# Altium schematic sheet main.SchDoc
size A; SheetNumber: 1; SheetTotal: 1
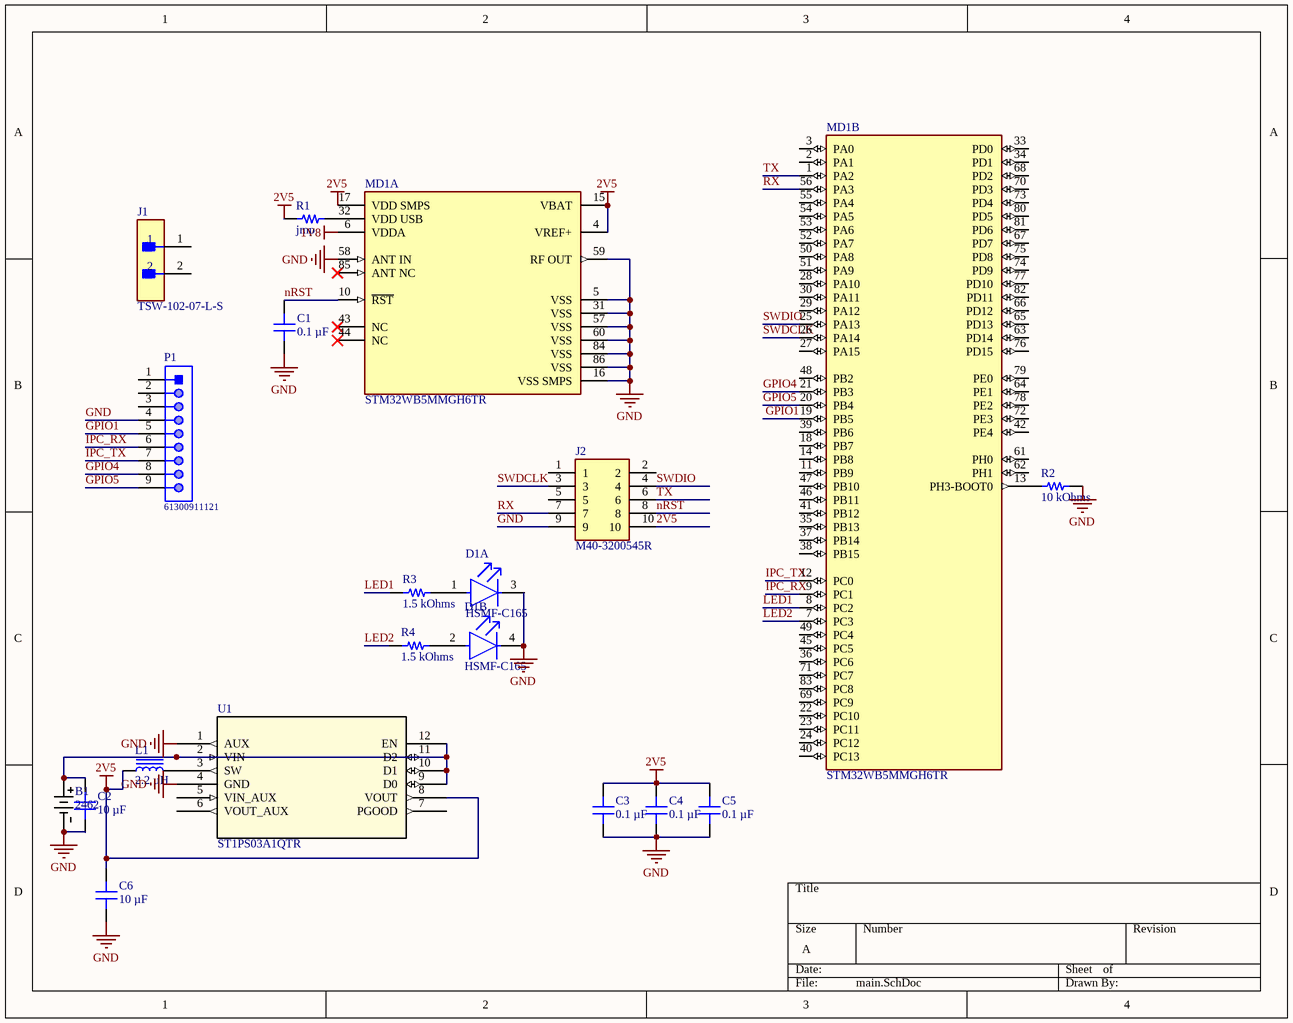
[diagram p0: main.SchDoc]

## Parts
B1  2462  [2462_KEY]
C1  0.1 µF  [CAP 0402_1005]
C2  10 µF  [CAP 0603_1608]
C3  0.1 µF  [CAP 0402_1005]
C4  0.1 µF  [CAP 0402_1005]
C5  0.1 µF  [CAP 0402_1005]
C6  10 µF  [CAP 0603_1608]
D1  HSMF-C165  [FP-HSMF-C165-MFG]  (parts A,B of 2)
J1  TSW-102-07-L-S  [FP-TSW-102-07-L-S-MFG]
J2  M40-3200545R  [HARWIN_M40-3200545R]
L1  2.2 µH  [TDK VLS201612CX]
MD1  STM32WB5MMGH6TR  [FP-STM32WB5MMGH6TR-MFG]  (parts A,B of 2)
P1  61300911121  [61300911121]
R1  jmp  [RES 0402_1005]
R2  10 kOhms  [RES 0402_1005]
R3  1.5 kOhms  [RES 0402_1005]
R4  1.5 kOhms  [RES 0402_1005]
U1  ST1PS03A1QTR  [TQFN12_2X1P7_STM]

## Nets
1V8: MD1.6(VDDA)
2V5: C3.2 C4.2 C5.2 C6.2 J2.10 L1.1 MD1.4(VREF+) MD1.15(VBAT) MD1.17(VDD_SMPS) R1.1 U1.8(VOUT)
GND: B1.1 C1.2 C2.1 C3.1 C4.1 C5.1 C6.1 D1.4(RED_C) J2.9 MD1.5(VSS) MD1.16(VSS_SMPS) MD1.31(VSS) MD1.57(VSS) MD1.58(ANT_IN) MD1.59(RF_OUT) MD1.60(VSS) MD1.84(VSS) MD1.86(VSS) P1.4 R2.1 U1.1(AUX) U1.4(GND)
GPIO1: MD1.19(PB5) P1.5
GPIO4: MD1.21(PB3) P1.8
GPIO5: MD1.20(PB4) P1.9
IPC_RX: MD1.9(PC1) P1.6
IPC_TX: MD1.12(PC0) P1.7
LED1: MD1.8(PC2) R3.2
LED2: MD1.7(PC3) R4.2
nRST: C1.1 J2.8 MD1.10(~{RST})
RX: J2.7 MD1.56(PA3)
SWDCLK: J2.3 MD1.26(PA14)
SWDIO: J2.4 MD1.25(PA13)
TX: J2.6 MD1.1(PA2)
NetB1_2: B1.2 C2.2 U1.2(VIN) U1.9(D0) U1.10(D1) U1.11(D2) U1.12(EN)
NetD1_1: D1.1(GREEN_A) R3.1
NetD1_2: D1.2(RED_A) R4.1
NetL1_2: L1.2 U1.3(SW)
NetMD1_13: MD1.13(PH3-BOOT0) R2.2
NetMD1_32: MD1.32(VDD_USB) R1.2

Not connected (* = marked no-connect by the designer): D1 3(GREEN_C); J1 1 2; J2 1 2 5; MD1 2(PA1) 3(PA0) 11(PB9) 14(PB8) 18(PB7) 22(PC10) 23(PC11) 24(PC12) 27(PA15) 28(PA10) 29(PA12) 30(PA11) 33(PD0) 34(PD1) 35(PB13) 36(PC6) 37(PB14) 38(PB15) 39(PB6) 40(PC13) 41(PB12) 42(PE4) 43(NC)* 44(NC)* 45(PC5) 46(PB11) 47(PB10) 48(PB2) 49(PC4) 50(PA8) 51(PA9) 52(PA7) 53(PA6) 54(PA5) 55(PA4) 61(PH0) 62(PH1) 63(PD14) 64(PE1) 65(PD13) 66(PD12) 67(PD7) 68(PD2) 69(PC9) 70(PD3) 71(PC7) 72(PE3) 73(PD4) 74(PD9) 75(PD8) 76(PD15) 77(PD10) 78(PE2) 79(PE0) 80(PD5) 81(PD6) 82(PD11) 83(PC8) 85(ANT_NC)*; P1 1 2 3; U1 5(VIN_AUX) 6(VOUT_AUX) 7(PGOOD)

## Library data of the parts
B1 = 2462: No Description Available; Mfr_Name: Keystone Electronics
C1 C4 C5 = C0402C104K7PAC7867: CAP CER 0.1UF 4V X5R 0402; manufacturer: KEMET; Tolerance: ±10%; Part Number: C0402C104K7PAC7867; Value: 0.1 µF; Applications: Bypass, Decoupling; Capacitance: 0.1 µF; componentlink1description: Datasheet; componentlink1url: https://api.kemet.com/component-edge/download/datasheet/C0402C104K7PAC7867.pdf; componentlink2description: DigiKey Link; componentlink2url: https://www.digikey.com/en/products/detail/kemet/C0402C104K7PAC7867/7381987; Device Package: 0402 (1005 Metric); lastupdated: 1/9/2022 12:30:40 pm; Lifecycle Status: Active; Minimum Order: 1; Mounting Type: Surface Mount, MLCC; Operating Temperature: -55°C ~ 85°C; Package / Case: 0402 (1005 Metric); packaging: TapeAndReel; partid: 5603; Part Status: Active; price: 0.01; series: SMD Comm X5R; Size / Dimension: 0.039" L x 0.020" W (1.00mm x 0.50mm); Supplier 1: DigiKey; Supplier Part Number 1: 399-14871-1-ND; Temperature Coefficient: X5R; Thickness (Max): 0.022" (0.55mm); Voltage - Rated: 4V
C2 C6 = GRM188R60J106ME47D: CAP CER 10UF 6.3V X5R 0603; manufacturer: Murata Electronics; Tolerance: ±20%; Part Number: GRM188R60J106ME47D; Value: 10 µF; Applications: General Purpose; Capacitance: 10 µF; componentlink1description: Datasheet; componentlink1url: https://www.murata.com/~/media/webrenewal/support/library/catalog/products/capacitor/mlcc/c02e.ashx?la=en-us; componentlink2description: DigiKey Link; componentlink2url: https://www.digikey.com/en/products/detail/murata-electronics/GRM188R60J106ME47D/965910; Device Package: 0603 (1608 Metric); lastupdated: 11/9/2022 9:40:24 am; Lifecycle Status: Active; Minimum Order: 1; Mounting Type: Surface Mount, MLCC; Operating Temperature: -55°C ~ 85°C; Package / Case: 0603 (1608 Metric); packaging: TapeAndReel; partid: 2351; Part Status: Active; price: 0.02; series: GRM; Size / Dimension: 0.063" L x 0.031" W (1.60mm x 0.80mm); Supplier 1: DigiKey; Supplier Part Number 1: 490-3896-1-ND; Temperature Coefficient: X5R; Thickness (Max): 0.035" (0.90mm); Voltage - Rated: 6.3V
C3 = C0402C104K4RECAUTO: CAP CER 0402 0.1UF 16V X7R 10%; manufacturer: KEMET; Part Number: C0402C104K4RECAUTO; Value: 0.1 µF; Applications: Automotive, ESD Protection; Capacitance: 0.1 µF; componentlink1description: Datasheet; componentlink1url: https://api.kemet.com/component-edge/download/datasheet/C0402C104K4RECAUTO.pdf; componentlink2description: DigiKey Link; componentlink2url: https://www.digikey.com/en/products/detail/kemet/C0402C104K4RECAUTO/8563695; Device Package: 0402 (1005 Metric); lastupdated: 1/9/2022 12:30:53 pm; Lifecycle Status: Active; Minimum Order: 1; Mounting Type: Surface Mount, MLCC; Operating Temperature: -55°C ~ 125°C; Package / Case: 0402 (1005 Metric); packaging: TapeAndReel; partid: 1731; Part Status: Active; price: 0.01; Ratings: AEC-Q200; series: ESD SMD Auto X7R; Size / Dimension: 0.039" L x 0.020" W (1.00mm x 0.50mm); Supplier 1: DigiKey; Supplier Part Number 1: 399-17167-1-ND; Temperature Coefficient: X7R; Thickness (Max): 0.022" (0.55mm); Tolerance: ±10%; Voltage - Rated: 16V
D1 = CMP-2000-06424-2: LED GREEN/RED DIFFUSED 0603 SMD; Reverse Voltage: 5V; Dominant Wavelength: 621nm; Number of Elements: 2; Shape: Rectangular; Luminous Intensity: 10mcd; Forward Current: 20mA; Lens Color: White; Illumination Color: Green; Power Dissipation: 52mW; Wavelength: 572nm; Viewing Angle: 120°; Forward Voltage: 2.2V; Max Operating Temperature: 85°C; Lens Transparency: Diffused; Width: 0.8mm; Case/Package: 0603; Packaging: Tape and Reel; Case Code (Metric): 1608; Depth: 0.8mm; REACH SVHC: No SVHC; Number of LEDs: 2; Radiation Hardening: No; Lens Style: Rectangular; Color: Green; Case Code (Imperial): 0603; Min Operating Temperature: -40°C; Power Rating: 52mW; Number of Pins: 4; Number of Terminals: 4; Package Quantity: 1; Mount: Surface Mount; Height: 0.5mm; Length: 1.6mm; Lead Free: Lead Free; Test Current: 20mA
J1 = CMP-02766-001428-1: CONN HEADER VERT 2POS 2.54MM; Voltage Rating: 550V; Current Rating: 7.6A; Gender: Male; Number of Contacts: 2; Connector Type: Male Pin; Radiation Hardening: No; Orientation: Straight; Contact Plating: Gold; Max Operating Temperature: 125°C; Mount: Through Hole; Package Quantity: 1; Number of Rows: 1; Housing Material: Polyester; RoHS Compliant: Yes; Length: 5.08mm; Max Voltage Rating (AC): 550V; Pitch: 2.54mm; Packaging: Bulk; Depth: 2.54mm; Termination: Solder; Min Operating Temperature: -55°C; Housing Color: Black; Lead Free: Lead Free; Color: Black; Number of Positions: 2; Width: 2.54mm; Max Current Rating: 7.6A; REACH SVHC: No SVHC; Contact Material: Bronze; Contact Mating Length: 0.23inch; Series: TSW; Contact Type: Male Pin
J2 = M40-3200545R: Connector Header Surface Mount 10 position 0.039 _1.00mm_; MF: Harwin Inc.; Package: None; MP: M40-3200545R; Value: *; Price: None; SnapEDA_Link: https://www.snapeda.com/parts/M40-3200545R/Harwin%20Inc./view-part/494409/?ref=snap; Availability: Unavailable
L1 = VLS201612CX-6R8M-1: FIXED IND 6.8UH 930MA 368MOHM SM; Manufacturer: TDK Corporation; Current - Saturation: 730mA; DC Resistance (DCR): 368mOhm Max; Inductance: 6.8 µH; Inductance Frequency - Test: 1 MHz; Material - Core: Ferrite; Shielding: Shielded; Tolerance: ±20%; Type: Drum Core, Wirewound; Part Number: VLS201612CX-6R8M-1; ComponentLink1Description: Datasheet; ComponentLink1URL: https://product.tdk.com/info/en/catalog/datasheets/inductor_commercial_power_vls201612cx-1_en.pdf?ref_disty=digikey; ComponentLink2Description: DigiKey Link; ComponentLink2URL: https://www.digikey.com/en/products/detail/tdk-corporation/VLS201612CX-6R8M-1/5169771; Current Rating (Amps): 930 mA; Device Package: Nonstandard; Height - Seated (Max): 0.047" (1.20mm); LastUpdated: 11/9/2022 10:31:03 am; Lifecycle Status: Active; Minimum Order: 1; Mounting Type: Surface Mount; Operating Temperature: -40°C ~ 105°C; Package / Case: Nonstandard; Packaging: TapeAndReel; PartId: 207; Part Status: Active; Price: 0.13; Series: VLS-CX-1; Size / Dimension: 0.079" L x 0.063" W (2.00mm x 1.60mm); Supplier 1: DigiKey; Supplier Part Number 1: 445-172966-1-ND; Supplier Device Package: 2016; Value: 2.2 µH
MD1 = CMP-12160-000017-1: ULTRA-LOW-POWER DUAL CORE ARM CO
P1 = CMP-1502-01080-1: THT Vertical Pin Header WR-PHD, Pitch 2.54 mm, Single Row, 9 pins; Manufacturer: Wurth Elektronik; Pitch: 2.54mm; Gender: Male; Working Voltage: 250VAC; Contact Resistance: 20mOhm; Withstanding Voltage: 500VAC; Pin Number: 9; Rated Current: 3A; Package Reference: 61300911121; Part Number: 61300911121; Mounting Technology: THT; Publisher: WurthElektronik; Manufacturer URL: http://www.we-online.de; Orientation: Vertical; Datasheet URL: https://katalog.we-online.de/em/datasheet/6130xx11121.pdf; Operating Temperature: -40to105degC; Row Number: Single; Packaging: Bag
R1 = RP73PF1E10KBTD: RES 10K OHM 0.1% 1/10W 0402; Manufacturer: TE Connectivity Passive Product; Power (Watts): 0.1W, 1/10W; Resistance: 10 kOhms; Temperature Coefficient: ±25ppm/°C; Part Number: RP73PF1E10KBTD; Value: jmp; ComponentLink1Description: Datasheet; ComponentLink1URL: https://www.te.com/commerce/DocumentDelivery/DDEController?Action=srchrtrv&DocNm=1773272&DocType=DS&DocLang=English; ComponentLink2Description: DigiKey Link; ComponentLink2URL: https://www.digikey.com/en/products/detail/te-connectivity-passive-product/RP73PF1E10KBTD/8260957; Composition: Thin Film; Device Package: 0402 (1005 Metric); Height - Seated (Max): 0.014" (0.35mm); LastUpdated: 1/9/2022 12:46:57 pm; Lifecycle Status: Active; Minimum Order: 1; Number of Terminations: 2; Operating Temperature: -55°C ~ 155°C; Package / Case: 0402 (1005 Metric); Packaging: TapeAndReel; PartId: 2434; Part Status: Active; Price: 0.09; Series: RP73, Holsworthy; Size / Dimension: 0.039" L x 0.020" W (1.00mm x 0.50mm); Supplier 1: DigiKey; Supplier Part Number 1: A127415CT-ND; Supplier Device Package: 0402; Tolerance: ±0.1%
R2 = RP73PF1E10KBTD: RES 10K OHM 0.1% 1/10W 0402; Manufacturer: TE Connectivity Passive Product; Power (Watts): 0.1W, 1/10W; Temperature Coefficient: ±25ppm/°C; Part Number: RP73PF1E10KBTD; Value: 10 kOhms; ComponentLink1Description: Datasheet; ComponentLink1URL: https://www.te.com/commerce/DocumentDelivery/DDEController?Action=srchrtrv&DocNm=1773272&DocType=DS&DocLang=English; ComponentLink2Description: DigiKey Link; ComponentLink2URL: https://www.digikey.com/en/products/detail/te-connectivity-passive-product/RP73PF1E10KBTD/8260957; Composition: Thin Film; Device Package: 0402 (1005 Metric); Height - Seated (Max): 0.014" (0.35mm); LastUpdated: 1/9/2022 12:46:57 pm; Lifecycle Status: Active; Minimum Order: 1; Number of Terminations: 2; Operating Temperature: -55°C ~ 155°C; Package / Case: 0402 (1005 Metric); Packaging: TapeAndReel; PartId: 2434; Part Status: Active; Price: 0.09; Resistance: 10 kOhms; Series: RP73, Holsworthy; Size / Dimension: 0.039" L x 0.020" W (1.00mm x 0.50mm); Supplier 1: DigiKey; Supplier Part Number 1: A127415CT-ND; Supplier Device Package: 0402; Tolerance: ±0.1%
R3 R4 = ERA-2VRW1501X: RES 1.5K OHM 0.05% 1/10W 0402; Manufacturer: Panasonic Electronic Components; Power (Watts): 0.1W, 1/10W; Temperature Coefficient: ±10ppm/°C; Part Number: ERA-2VRW1501X; Value: 1.5 kOhms; ComponentLink1Description: Datasheet; ComponentLink1URL: https://api.pim.na.industrial.panasonic.com/file_stream/main/fileversion/9152; ComponentLink2Description: DigiKey Link; ComponentLink2URL: https://www.digikey.com/en/products/detail/panasonic-electronic-components/ERA-2VRW1501X/12086957; Composition: Thin Film; Device Package: 0402 (1005 Metric); Features: Anti-Sulfur, Automotive AEC-Q200; Height - Seated (Max): 0.016" (0.40mm); LastUpdated: 11/9/2022 9:53:08 am; Lifecycle Status: Active; Minimum Order: 1; Number of Terminations: 2; Operating Temperature: -55°C ~ 155°C; Package / Case: 0402 (1005 Metric); Packaging: TapeAndReel; PartId: 67400; Part Status: Active; Price: 0.24; Ratings: AEC-Q200; Resistance: 1.5 kOhms; Series: ERA-2V; Size / Dimension: 0.039" L x 0.020" W (1.00mm x 0.50mm); Supplier 1: DigiKey; Supplier Part Number 1: 10-ERA-2VRW1501XCT-ND; Supplier Device Package: 0402; Tolerance: ±0.05%
U1 = ST1PS03A1QTR: No Description Available; Mfr_Name: STMicroelectronics; RefDes: RefDes; Type: Type